# Altium schematic sheet Powersupply.SchDoc
size A3
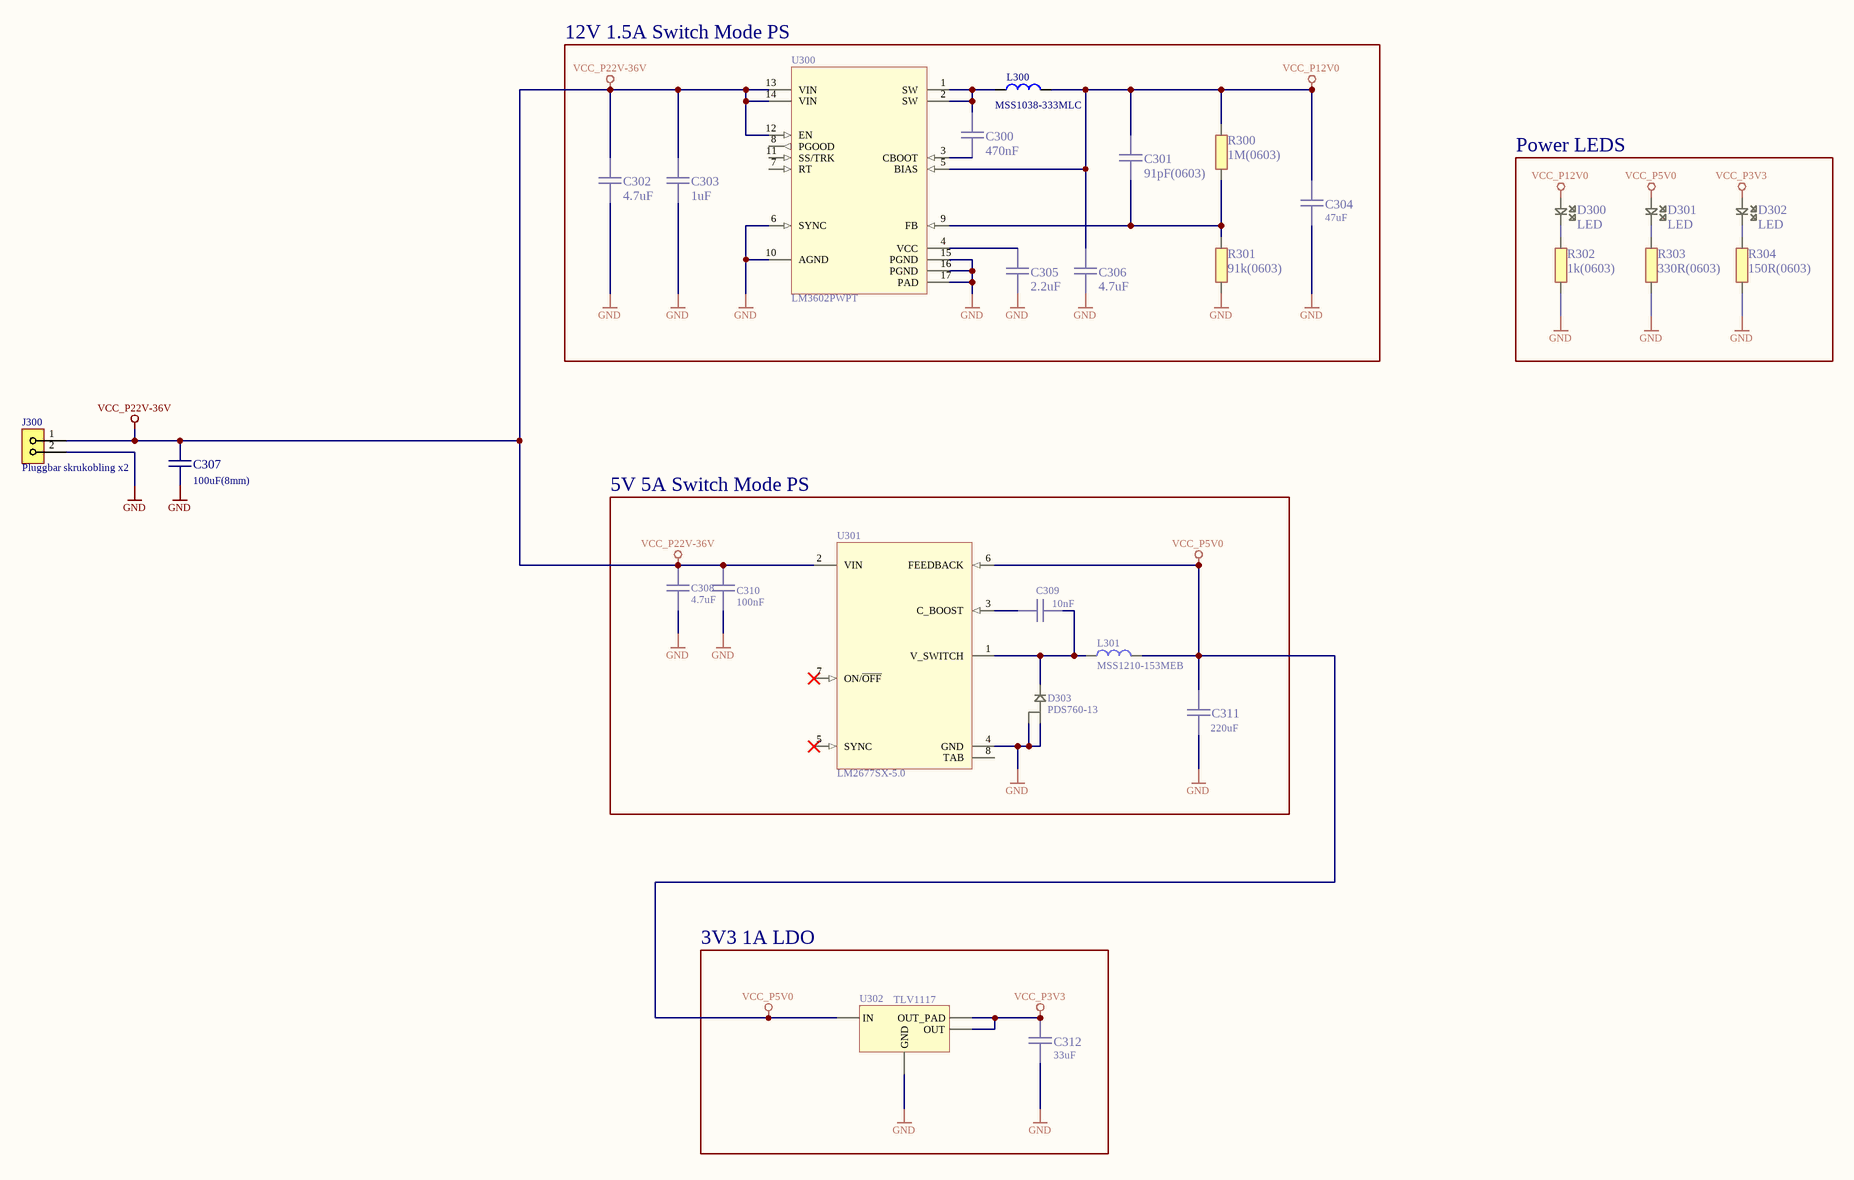
[diagram p0: Powersupply.SchDoc]

## Parts
C300  470nF  [CAPC0805(2012)100_N]
C301  91pF(0603)  [CAPC0603(1608)55_N]
C302  4.7uF  [CAPC1206(3216)170_N]
C303  1uF  [CAPC1206(3216)170_N]
C304  verdi: 47uF  [CAPMP7342X30N]  (hidden comment: T495D476M025ATE120)
C305  2.2uF  [CAPC0603(1608)55_N]
C306  4.7uF  [CAPC1206(3216)170_N]
C307  100uF(8mm)  [CAPPR35D08H11]
C308  4.7uF  [CAPC1206(3216)170_N]
C309  10nF  [CAPC0805(2012)100_N]
C310  100nF  [CAPC0805(2012)100_N]
C311  verdi: 220uF  [CAPMP7342X30N]  (hidden comment: 10TPB220ML)
C312  verdi: 33uF  [CAPMP7342X30N]  (hidden comment: 10TPB33M)
D300  LED  [I_LEDC0603(1608)_N]
D301  LED  [I_LEDC0603(1608)_N]
D302  LED  [I_LEDC0603(1608)_N]
D303  PDS760-13  [DFN540P650X115-3N]
J300  Pluggbar skrukobling x2  [FCI-20020110-C021A01LF]
L300  MSS1038-333MLC  [INDP102100X40N]
L301  MSS1210-153MEB  [INDP123123X100N]
R300  1M(0603)  [RESC0603(1608)_N]
R301  91k(0603)  [RESC0603(1608)_N]
R302  1k(0603)  [RESC0603(1608)_N]
R303  330R(0603)  [RESC0603(1608)_N]
R304  150R(0603)  [RESC0603(1608)_N]
U300  LM3602PWPT  [HTSSOP65P640X120_HS-17N]
U301  LM2677SX-5.0  [DPAK127P1336X457-8N]
U302  TLV1117  [SOT230P700X180-4N]

## Blocks framed on the sheet
12V 1.5A Switch Mode PS: C300-C306 L300 R300 R301 U300
Power LEDS: D300-D302 R302-R304
5V 5A Switch Mode PS: C308-C311 D303 L301 U301
3V3 1A LDO: C312 U302

## Nets
GND: C302.1 C303.1 C304.1 C305.1 C306.1 C307.1 C308.1 C310.1 C311.1 C312.1 D303.1(A) D303.2(A) J300.2 R301.1 R302.1 R303.1 R304.1 U300.6(SYNC) U300.10(AGND) U300.15(PGND) U300.16(PGND) U300.17(PAD) U301.4(GND) U302.1(GND)
VCC_P3V3: C312.2 D302.1 U302.2(OUT_PAD) U302.4(OUT)
VCC_P5V0: C311.2 D301.1 L301.2 U301.6(FEEDBACK) U302.3(IN)
VCC_P12V0: C301.2 C304.2 C306.2 D300.1 L300.2 R300.2 U300.5(BIAS)
VCC_P22V-36V: C302.2 C303.2 C307.2 C308.2 C310.2 J300.1 U300.12(EN) U300.13(VIN) U300.14(VIN) U301.2(VIN)
NetC300_1: C300.1 U300.3(CBOOT)
NetC300_2: C300.2 L300.1 U300.1(SW) U300.2(SW)
NetC301_1: C301.1 R300.1 R301.2 U300.9(FB)
NetC305_2: C305.2 U300.4(VCC)
NetC309_1: C309.1 U301.3(C_BOOST)
NetC309_2: C309.2 D303.3(K) L301.1 U301.1(V_SWITCH)
NetD300_2: D300.2 R302.2
NetD301_2: D301.2 R303.2
NetD302_2: D302.2 R304.2

Not connected (* = marked no-connect by the designer): U300 7(RT) 8(PGOOD) 11(SS/TRK); U301 5(SYNC)* 7(ON/~{OFF})* 8(TAB)

## Library data of the parts
C300 = 470nF: 470nF 0805 chip X7R 50V; pakke_opprettet_av: 815; leverandor_varenr: 2320847; pris: 1; nokkelord: Kondensator, capacitor; pakketype: 94; produsent: Multikomp; leverandor: Farnell; navn: 470nF; pakke_opprettet: 14.11.2014 20:52:01; symbol_opprettet_av: 815; symbol_opprettet: 14.11.2014 20:19:34
C301 = 91pF(0603): 100nF 0603 5% NP0 50V; pakke_opprettet_av: 815; leverandor_varenr: 1865484; pris: 1; nokkelord: Kondensator, Capacitor, CAP; pakketype: 93; produsent: Kemet; leverandor: Farnell; id: 3026; navn: 91pF(0603); pakke_opprettet: 18.02.2015 14:18:13; symbol_opprettet_av: 815; symbol_opprettet: 14.11.2014 20:19:34
C302 C306 C308 = 4.7uF: 100nF 1206 chip X7R 50V; pakke_opprettet_av: 815; pris: 1; nokkelord: Kondensator, capacitor; pakketype: 95; produsent: Multikomp; navn: 4.7uF; pakke_opprettet: 11.02.2015 13:21:22; symbol_opprettet_av: 815; symbol_opprettet: 14.11.2014 20:19:34
C303 = 1uF: 1uF 1206 chip X7R 50V; pakke_opprettet_av: 815; leverandor_varenr: 1759454; pris: 2; nokkelord: Kondensator, capacitor; pakketype: 95; produsent: Multikomp; leverandor: Farnell; navn: 1uF; pakke_opprettet: 11.02.2015 13:21:22; symbol_opprettet_av: 815; symbol_opprettet: 14.11.2014 20:19:34
C304 = T495D476M025ATE120: Manufacturer: Kemet; Farnell: 2395821; MPN: T495D476M025ATE120
C305 = 2.2uF: 2.2uF 0603 chip X7R 6.3V; pakke_opprettet_av: 815; leverandor_varenr: 2320810; pris: 1; nokkelord: Kondensator, capacitor; pakketype: 93; produsent: Multikomp; leverandor: Farnell; navn: 2.2uF; pakke_opprettet: 18.02.2015 14:18:13; symbol_opprettet_av: 815; symbol_opprettet: 14.11.2014 20:19:34
C307 = 100uF(8mm): D=8mm Radial, 20% 50V 3,5mm pitch; pakke_opprettet_av: 815; leverandor_varenr: 1902932; pris: 2; nokkelord: Kondensator, Capacitor, CAP; pakketype: 92; produsent: Multikomp; leverandor: Farnell; id: 3027; navn: 100uF(8mm); pakke_opprettet: 25.02.2015 11:22:52; symbol_opprettet_av: 815; symbol_opprettet: 14.11.2014 20:19:34
C309 = 10nF: 100nF 0805 chip X7R 50V; pakke_opprettet_av: 815; pris: 1; nokkelord: Kondensator, capacitor; pakketype: 94; produsent: Multikomp; navn: 10nF; pakke_opprettet: 14.11.2014 20:52:01; symbol_opprettet_av: 815; symbol_opprettet: 14.11.2014 20:19:34
C310 = 100nF: 100nF 0805 chip X7R 50V; pakke_opprettet_av: 815; leverandor_varenr: 2408556; pris: 1; nokkelord: Kondensator, capacitor; pakketype: 94; produsent: Multikomp; leverandor: Farnell; navn: 100nF; pakke_opprettet: 14.11.2014 20:52:01; symbol_opprettet_av: 815; symbol_opprettet: 14.11.2014 20:19:34
C311 = 10TPB220ML: Varenummer: 2354821; Leverandør: Farnell
C312 = 10TPB33M: Varenummer: 2354816; Leverandør: Farnell
D300-D302 = SMD LED Red: SMD; rad: 0; rom: OV; lager_type: Fremlager; dybde: 2; hylle: 13; antall: 50; pakke_opprettet_av: 815; leverandor_varenr: 8554641; pris: 1; pakketype: 93; produsent: Avago; leverandor: Farnell; id: 2209; navn: SMD LED Red; kolonne: 0; pakke_opprettet: 06.07.2014 18:55:44; symbol_opprettet_av: 815; symbol_opprettet: 06.07.2014 18:59:47; nokkelord: SMD
D303 = PDS760-13: SCHOTTKY RECTIFIER POWERDI5; Leverandør: Farnell; Varenummer: 1713915
J300 = Pluggbar skrukobling x2: Skruplint; pakke_opprettet_av: 815; leverandor_varenr: 1787816; pris: 3; pakketype: 92; produsent: FCI; leverandor: Farnell; id: 2218; navn: Pluggbar skrukobling x2; pakke_opprettet: 13.11.2014 14:07:06; symbol_opprettet_av: 815; symbol_opprettet: 13.11.2014 10:58:53
L300 = MSS1038-333MLC: INDUCTOR, PWR, 33UH, 2.3A, 20%,13MHZ; Farnell: 2288211; MPN: MSS1038-333MLC
L301 = MSS1210-153MEB: INDUCTOR, PWR, 15UH, 8.7A, 20%,12MHZ; Farnell: 2288331
R300 = 3025: 0603 0.1W 1% Thick film resistor; id: 3025; rad: -1; rom: OV; lager_type: Fremlager; dybde: 119; hylle: 6; antall: 100; kolonne: 0; pakke_opprettet_av: 815; symbol_opprettet_av: oystesm; nokkelord: Resistor Motstand; pakketype: 93; pakke_opprettet: 08.07.2014 21:15:30; symbol_opprettet: 08.07.2014 21:16:33; navn: 1M(0603); pris: 0
R301 = 2997: 91k 0603 0.1W 1% Thick film resistor; id: 2997; rad: -1; rom: OV; lager_type: Fremlager; dybde: 95; hylle: 6; antall: 100; kolonne: 0; pakke_opprettet_av: 815; symbol_opprettet_av: oystesm; leverandor_varenr: 9331620; pakketype: 93; produsent: Multikomp; leverandor: Farnell; pakke_opprettet: 08.07.2014 21:15:30; symbol_opprettet: 08.07.2014 21:16:33; navn: 91k(0603); pris: 0; nokkelord: Resistor
R302 = 3029: 0603 0.1W 1% Thick film resistor; id: 3029; pakke_opprettet_av: 815; symbol_opprettet_av: oystesm; pris: 0; nokkelord: Resistor Motstand; pakketype: 93; produsent: Multikomp; pakke_opprettet: 08.07.2014 21:15:30; symbol_opprettet: 08.07.2014 21:16:33; navn: 1k(0603)
R303 = 2448: 330R 0603 0.1W 1% Thick film resistor; id: 2448; rad: -1; rom: OV; lager_type: Fremlager; dybde: 42; hylle: 6; antall: 100; kolonne: 0; pakke_opprettet_av: 815; symbol_opprettet_av: oystesm; nokkelord: Resistor Motstand; pakketype: 93; pakke_opprettet: 08.07.2014 21:15:30; symbol_opprettet: 08.07.2014 21:16:33; navn: 330R(0603); pris: 0
R304 = 3031: 0603 0.1W 1% Thick film resistor; id: 3031; pakke_opprettet_av: 815; symbol_opprettet_av: oystesm; pris: 0; nokkelord: Motstand, Resistor; pakketype: 93; produsent: Multikomp; pakke_opprettet: 08.07.2014 21:15:30; symbol_opprettet: 08.07.2014 21:16:33; navn: 150R(0603)
U300 = LM3602PWPT: MPN: LM43602PWPT; Manufacturer: Texas Instruments; Farnell: 2425776
U301 = LM2677SX-5.0: Leverandør: DigiKey; Varenummer: LM2677S-5.0/NOPB-ND
U302 = TLV1117: Low dropout regulator; pakke_opprettet_av: 774; leverandor_varenr: 1494942; pris: 5; nokkelord: ldo; pakketype: 77; produsent: Texas Instruments; leverandor: Farnell; navn: TLV1117; pakke_opprettet: 11.07.2014 22:00:23; symbol_opprettet_av: 774; symbol_opprettet: 11.07.2014 22:01:42